# Altium schematic sheet 0241_GPU DECOUPLING_ V1.SchDoc
size 848 x 558 mm
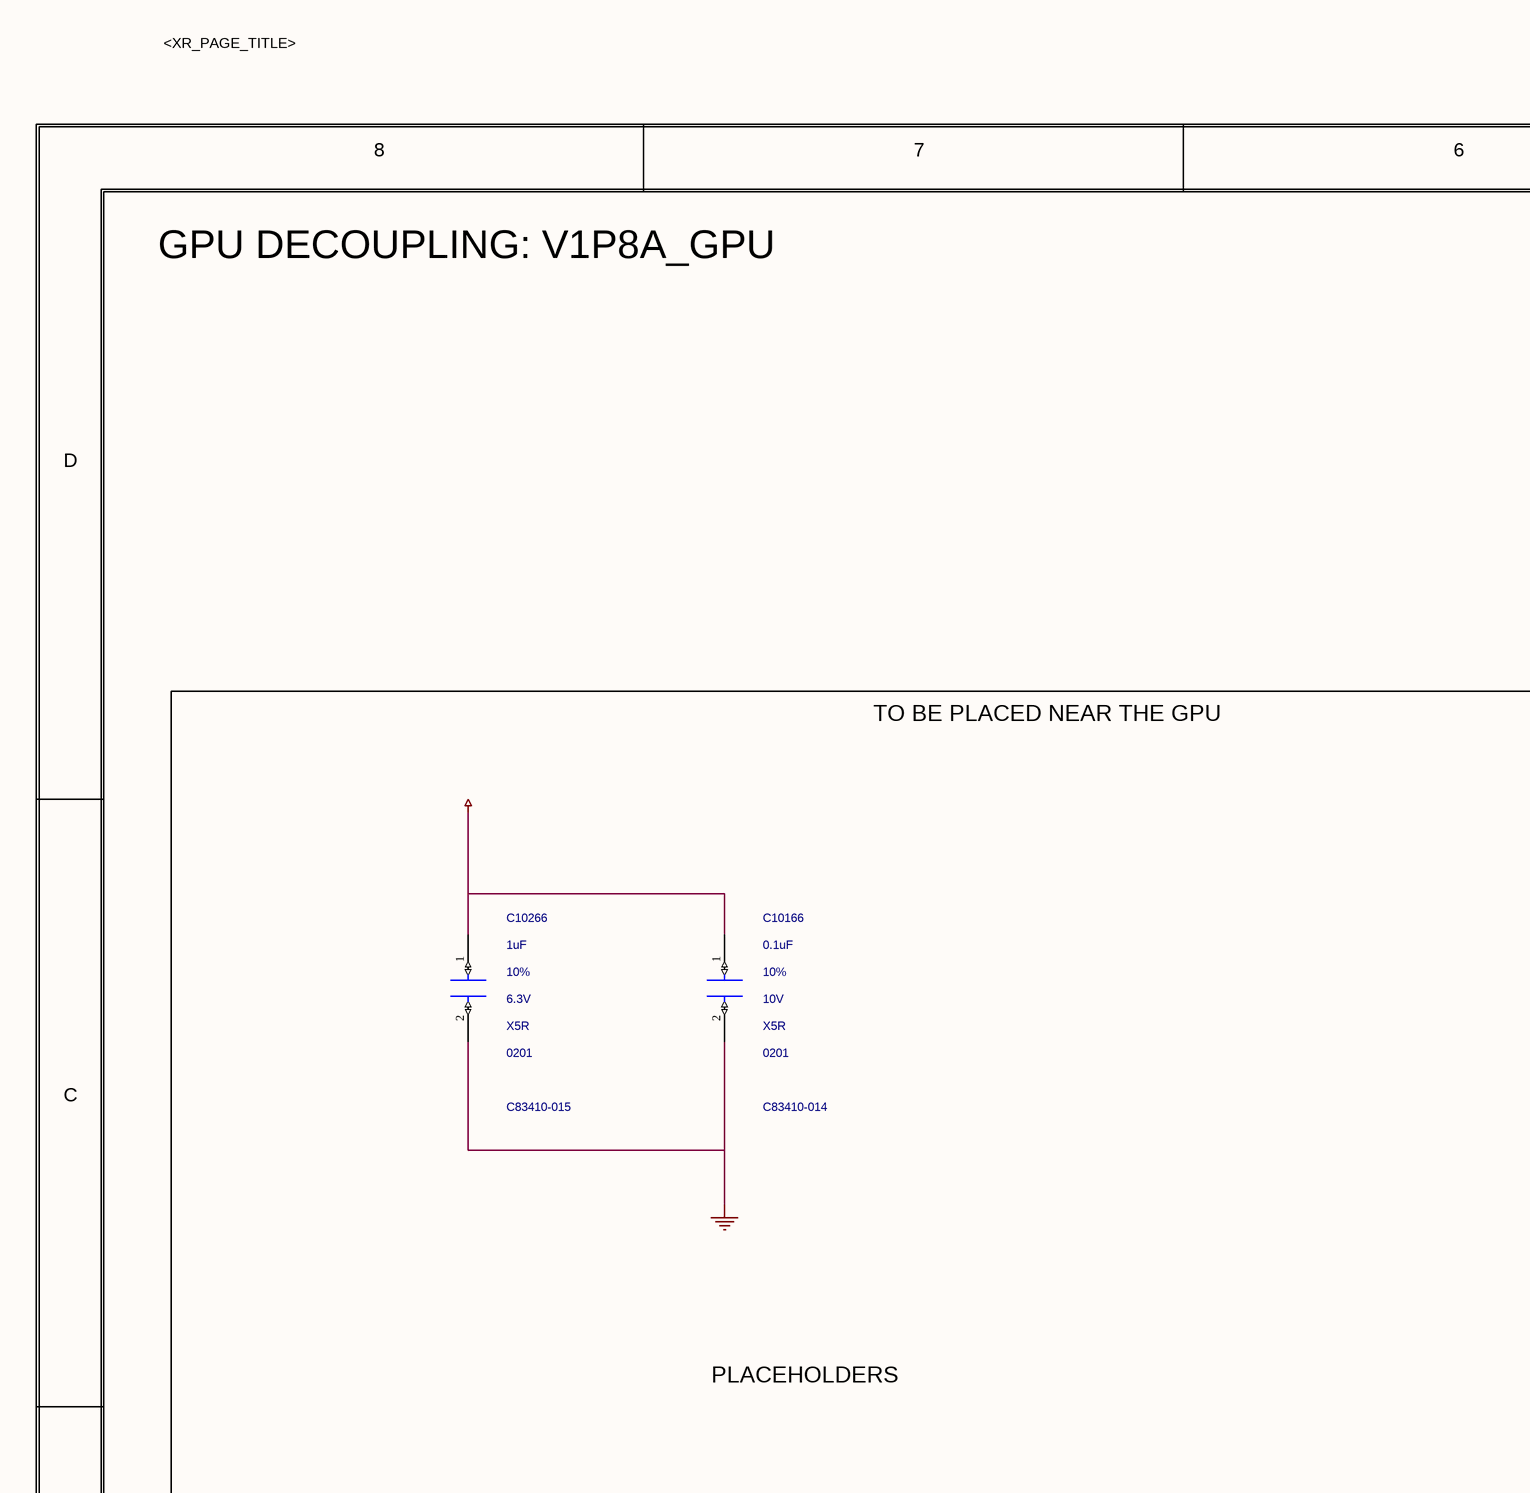
[diagram p0: 0241_GPU DECOUPLING_ V1.SchDoc, top left]
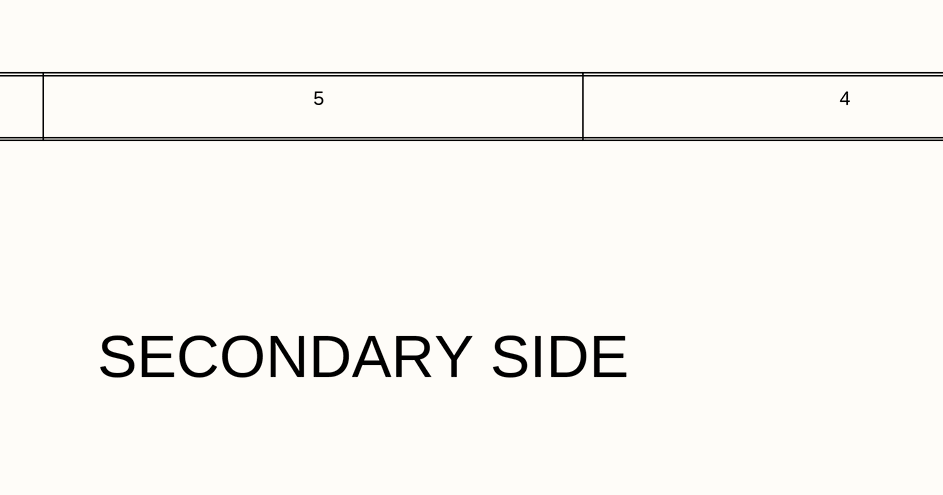
[diagram p1: 0241_GPU DECOUPLING_ V1.SchDoc, top middle]
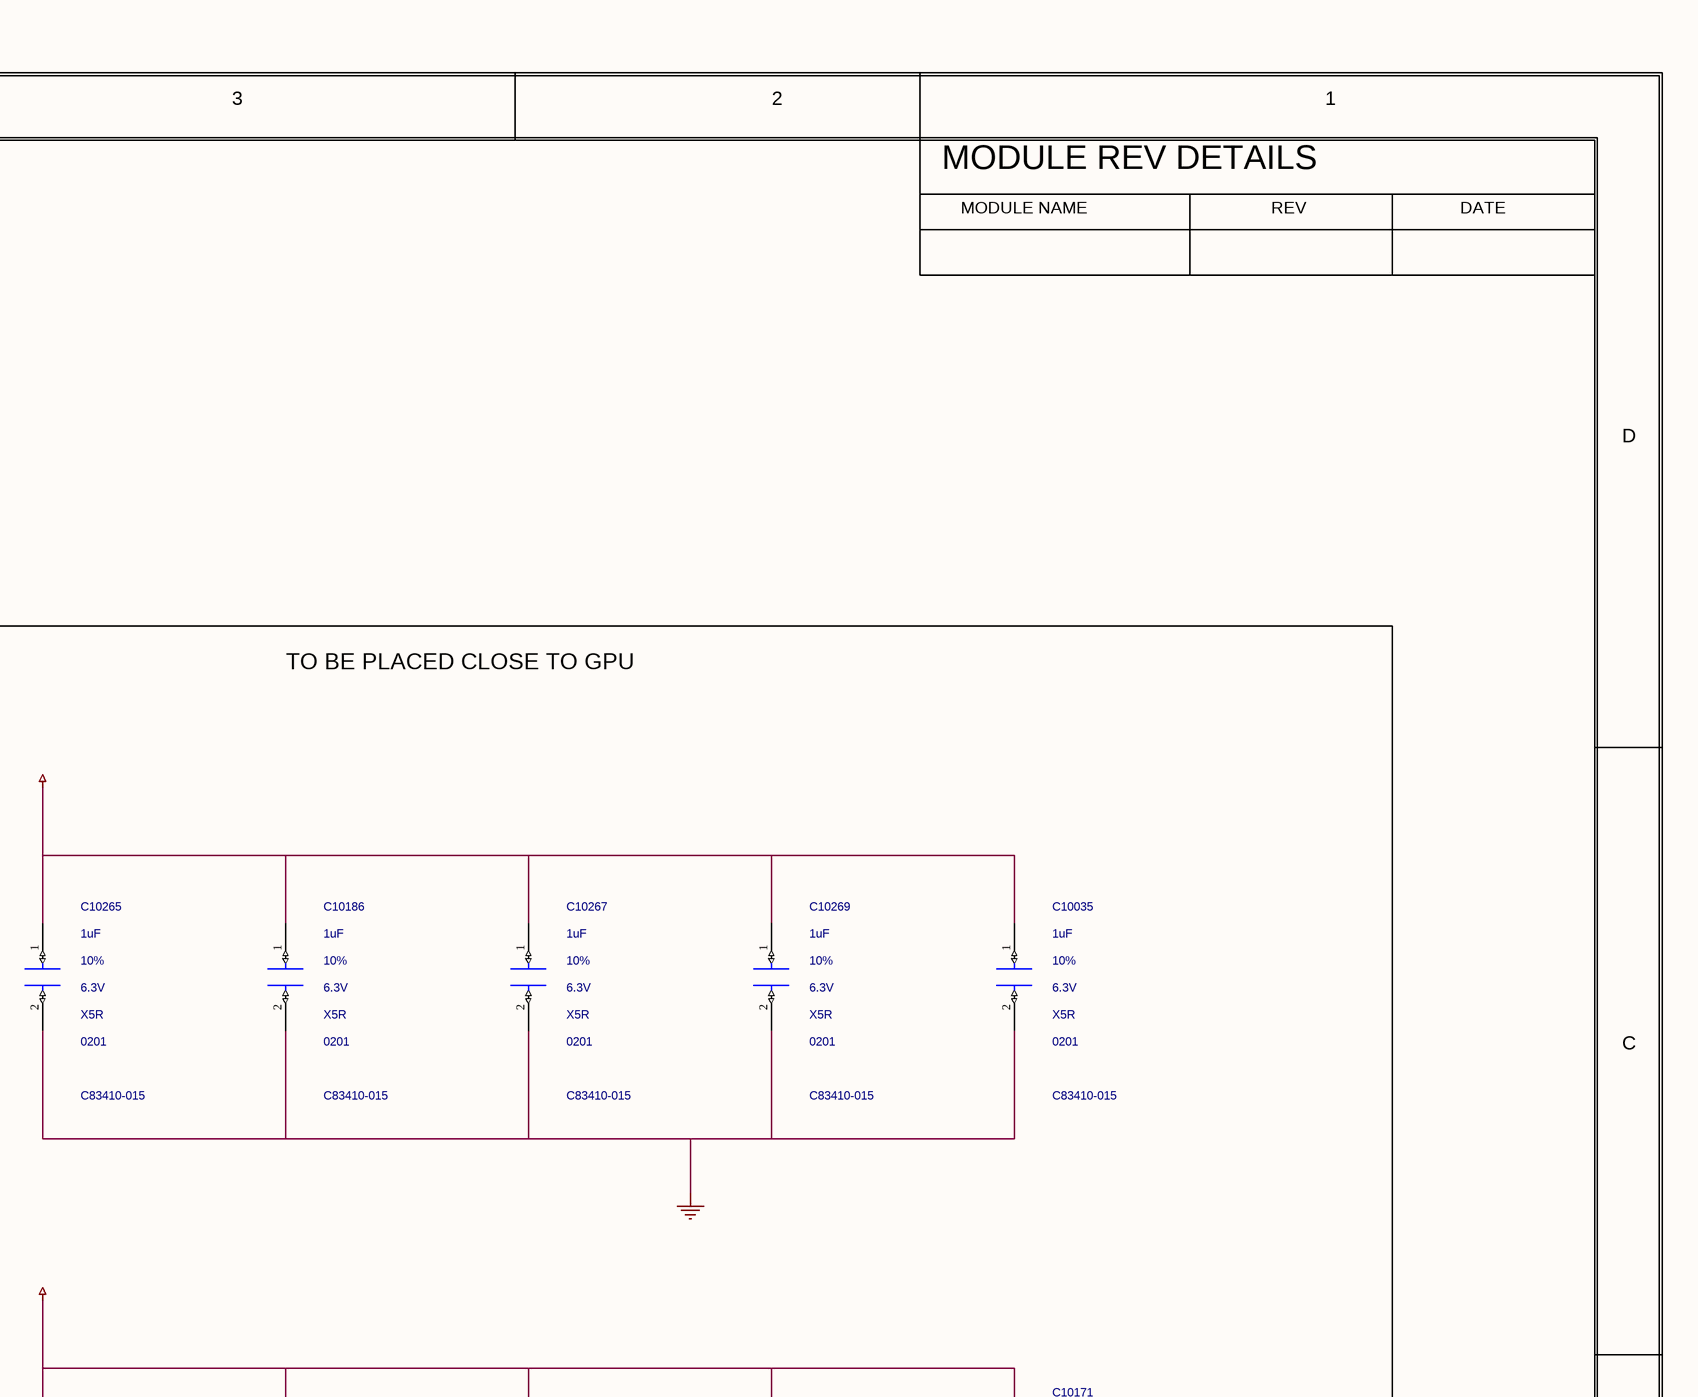
[diagram p2: 0241_GPU DECOUPLING_ V1.SchDoc, top right]
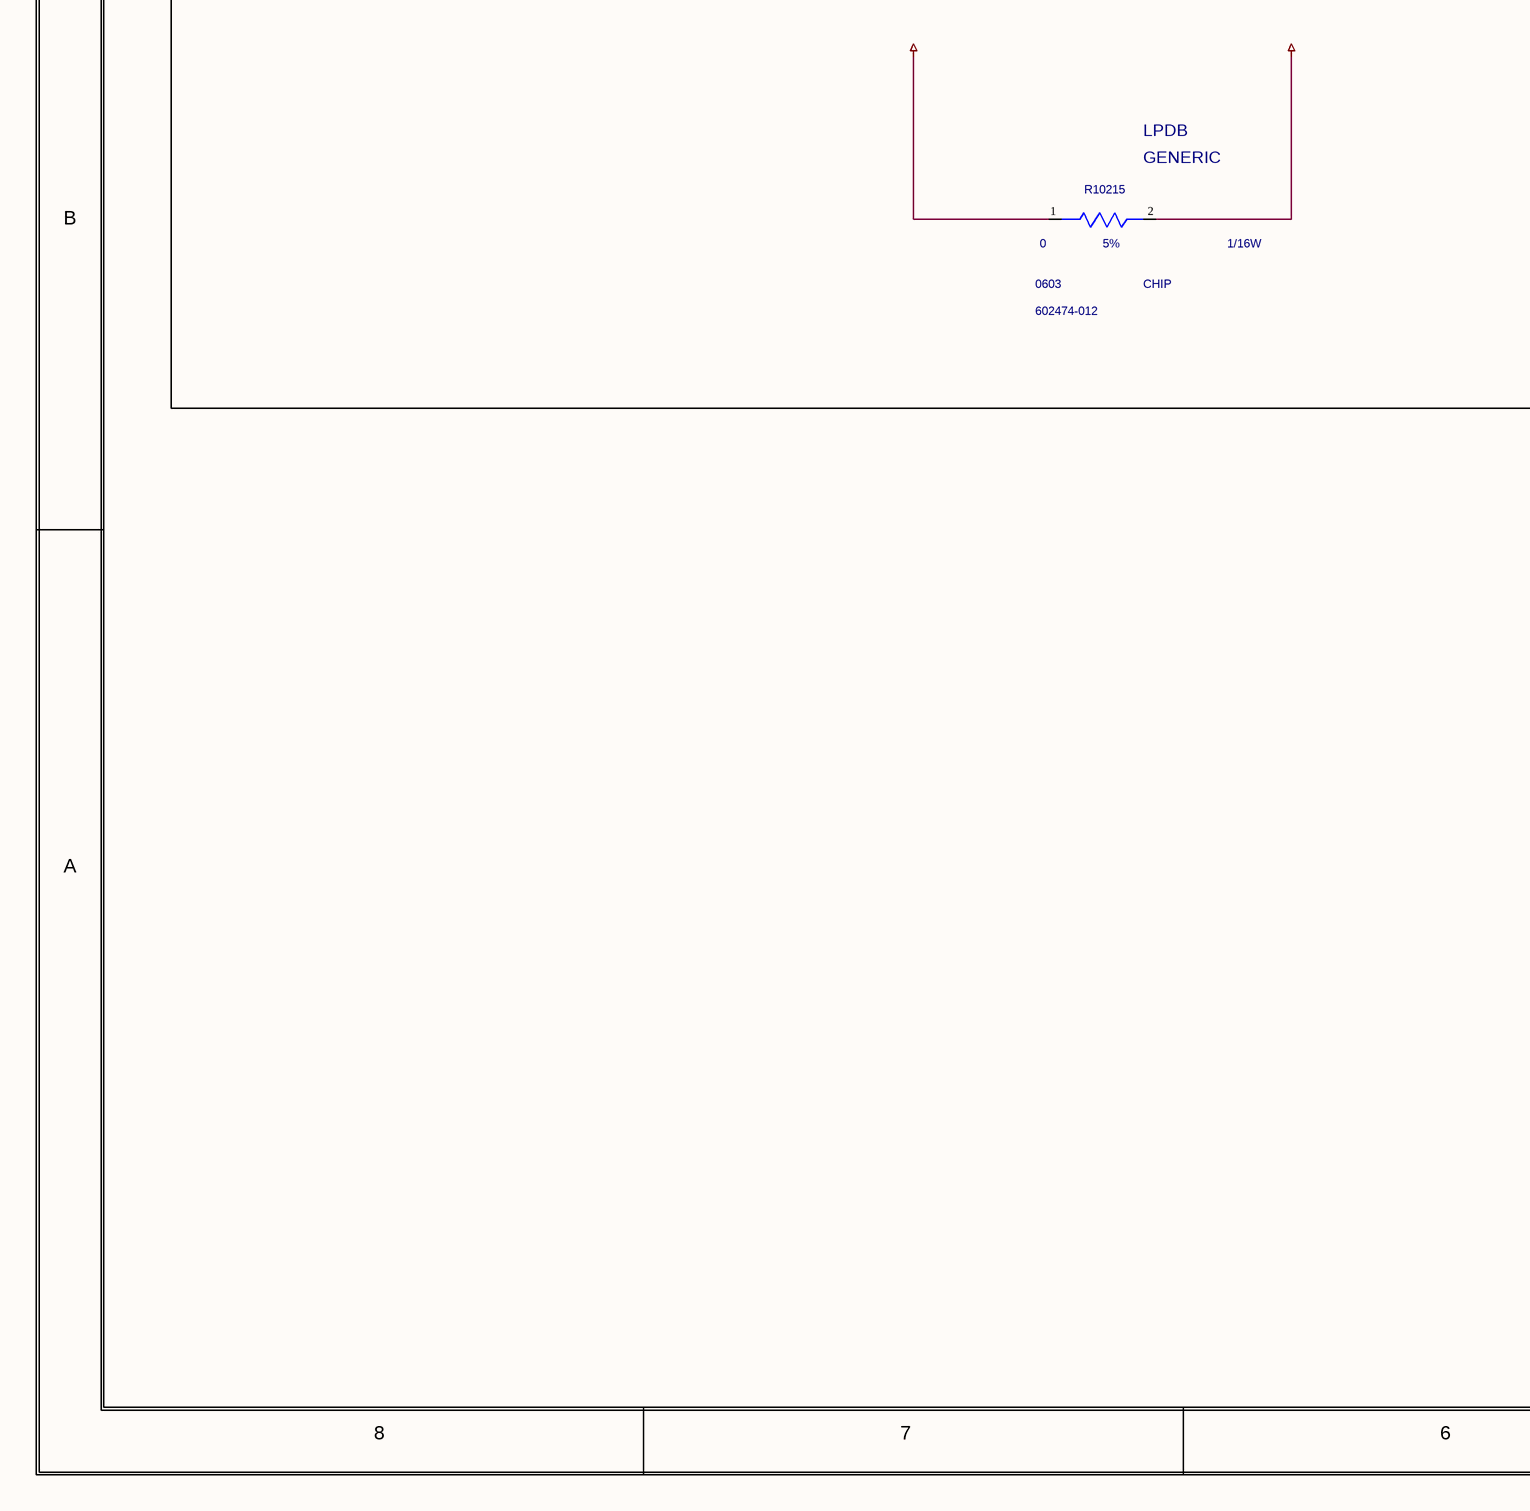
[diagram p3: 0241_GPU DECOUPLING_ V1.SchDoc, bottom left]
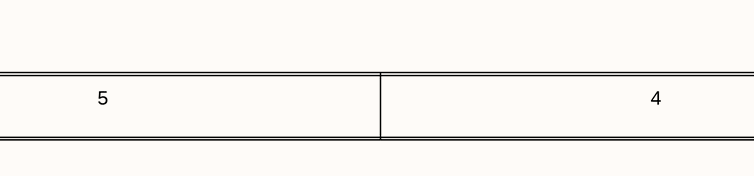
[diagram p4: 0241_GPU DECOUPLING_ V1.SchDoc, bottom middle]
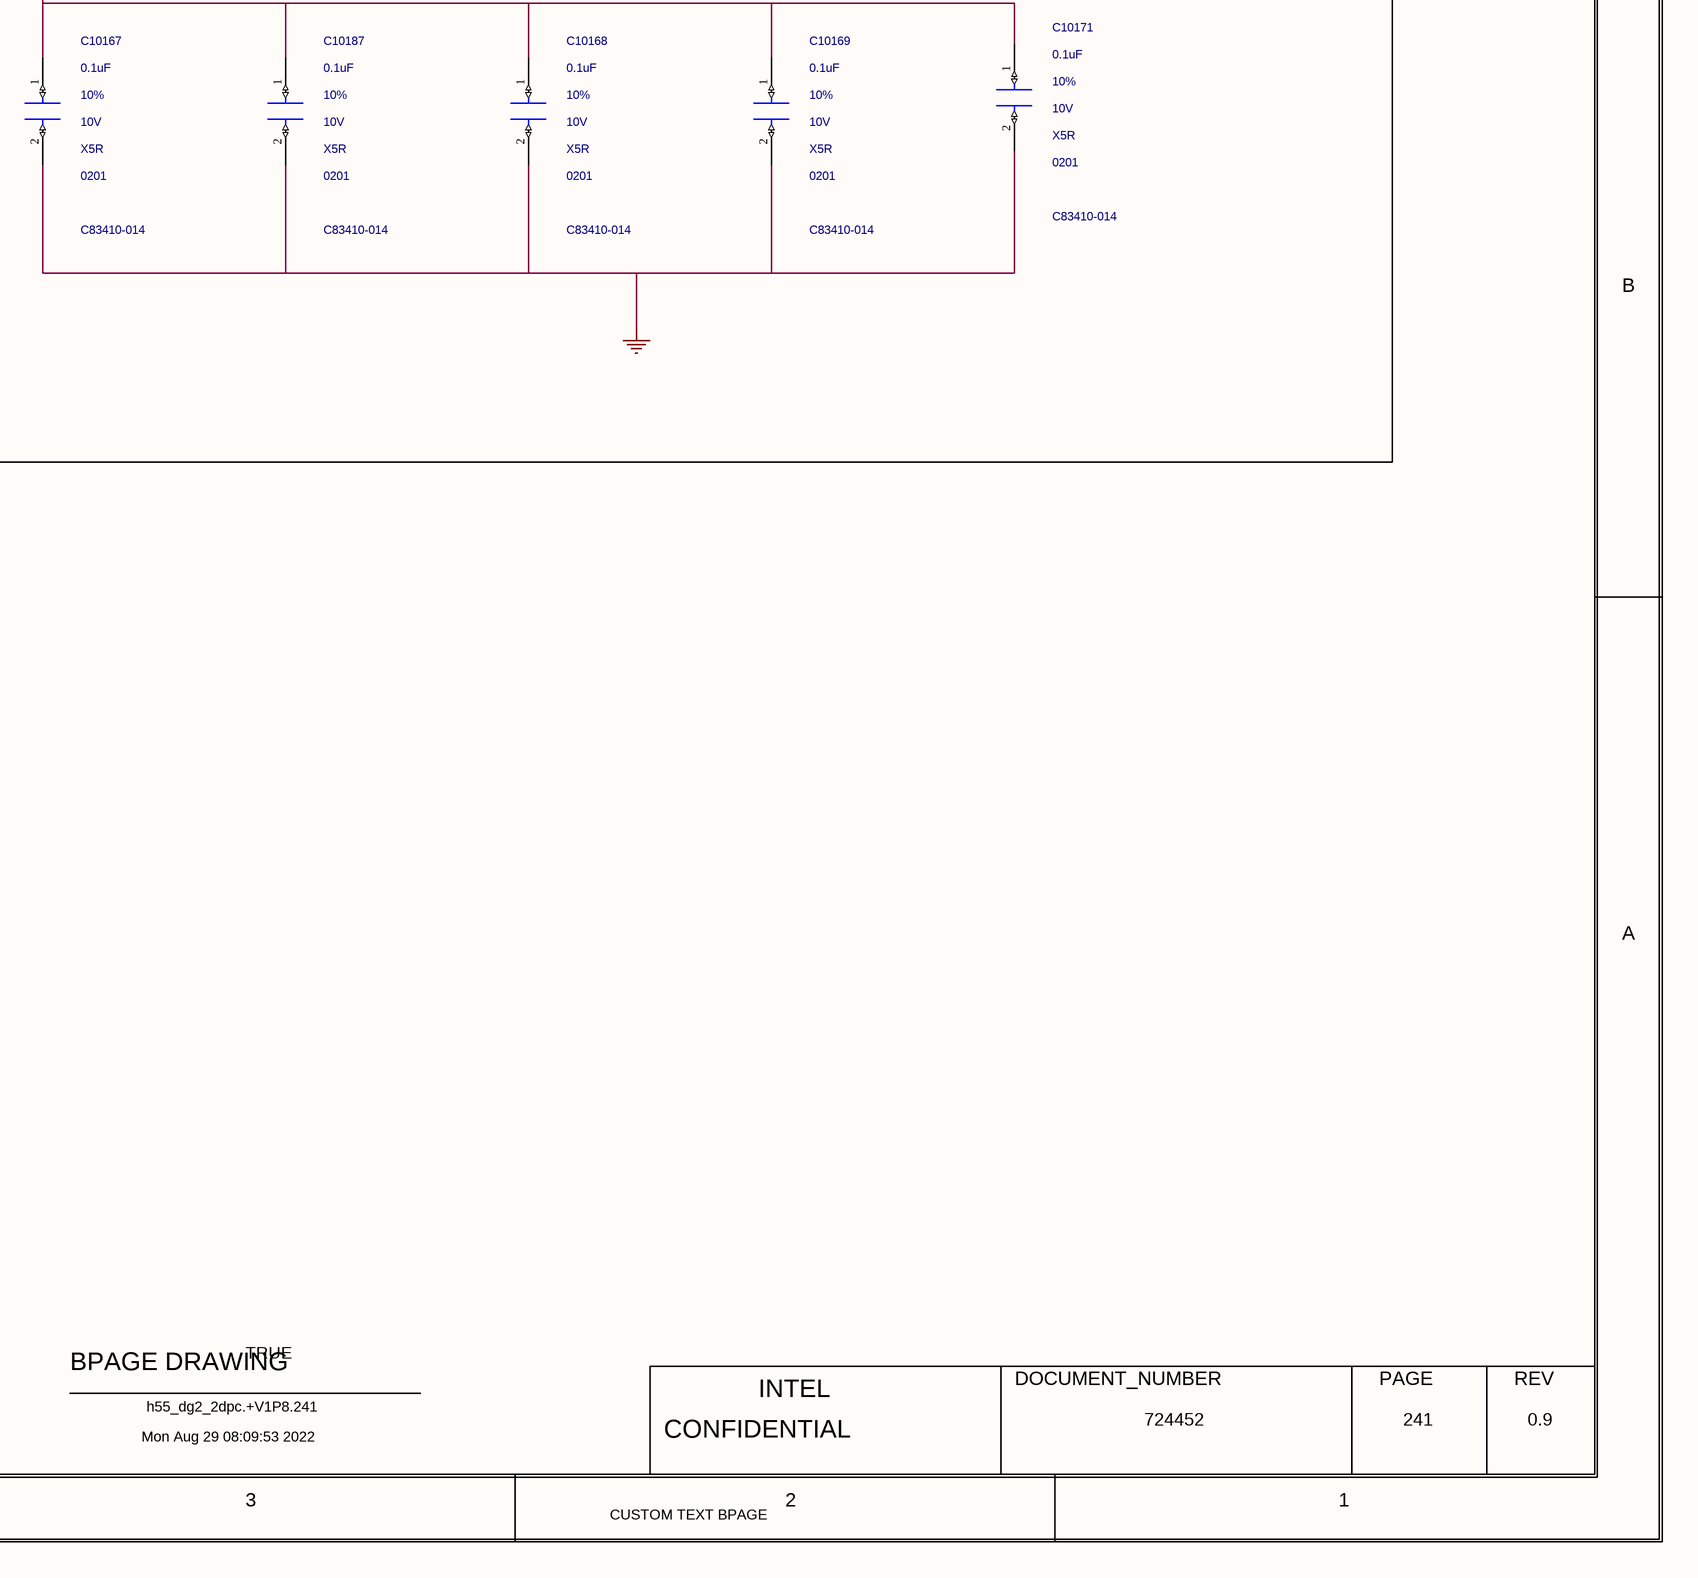
[diagram p5: 0241_GPU DECOUPLING_ V1.SchDoc, bottom right]

## Parts
C10035  1uF  MATERIAL: X5R  PACK_TYPE: 0201  PART_NUMBER: C83410-015  TOLERANCE: 10%  VOLTAGE: 6.3V  [SMC0201IA]
C10166  0.1uF  MATERIAL: X5R  PACK_TYPE: 0201  PART_NUMBER: C83410-014  TOLERANCE: 10%  VOLTAGE: 10V  [SMC0201IA]
C10167  0.1uF  MATERIAL: X5R  PACK_TYPE: 0201  PART_NUMBER: C83410-014  TOLERANCE: 10%  VOLTAGE: 10V  [SMC0201IA]
C10168  0.1uF  MATERIAL: X5R  PACK_TYPE: 0201  PART_NUMBER: C83410-014  TOLERANCE: 10%  VOLTAGE: 10V  [SMC0201IA]
C10169  0.1uF  MATERIAL: X5R  PACK_TYPE: 0201  PART_NUMBER: C83410-014  TOLERANCE: 10%  VOLTAGE: 10V  [SMC0201IA]
C10171  0.1uF  MATERIAL: X5R  PACK_TYPE: 0201  PART_NUMBER: C83410-014  TOLERANCE: 10%  VOLTAGE: 10V  [SMC0201IA]
C10186  1uF  MATERIAL: X5R  PACK_TYPE: 0201  PART_NUMBER: C83410-015  TOLERANCE: 10%  VOLTAGE: 6.3V  [SMC0201IA]
C10187  0.1uF  MATERIAL: X5R  PACK_TYPE: 0201  PART_NUMBER: C83410-014  TOLERANCE: 10%  VOLTAGE: 10V  [SMC0201IA]
C10265  1uF  MATERIAL: X5R  PACK_TYPE: 0201  PART_NUMBER: C83410-015  TOLERANCE: 10%  VOLTAGE: 6.3V  [SMC0201IA]
C10266  1uF  MATERIAL: X5R  PACK_TYPE: 0201  PART_NUMBER: C83410-015  TOLERANCE: 10%  VOLTAGE: 6.3V  [SMC0201IA]
C10267  1uF  MATERIAL: X5R  PACK_TYPE: 0201  PART_NUMBER: C83410-015  TOLERANCE: 10%  VOLTAGE: 6.3V  [SMC0201IA]
C10269  1uF  MATERIAL: X5R  PACK_TYPE: 0201  PART_NUMBER: C83410-015  TOLERANCE: 10%  VOLTAGE: 6.3V  [SMC0201IA]
R10215  0  MATERIAL: CHIP  PACK_TYPE: 0603  PART_NUMBER: 602474-012  TOLERANCE: 5%  WATTAGE: 1/16W  IP: GENERIC  FP_TECH: LPDB  [SMR0603IA]

## Blocks framed on the sheet
TO BE PLACED CLOSE TO GPU: C10035 C10167-C10169 C10171 C10186 C10187 C10265 C10267 C10269

## Nets
+V1P8_PLLVPH: C10166.1(A) C10266.1(A) R10215.1(A)
+V1P8S_GPU: C10035.1(A) C10167.1(A) C10168.1(A) C10169.1(A) C10171.1(A) C10186.1(A) C10187.1(A) C10265.1(A) C10267.1(A) C10269.1(A) R10215.2(B)
GND: C10035.2(B) C10166.2(B) C10167.2(B) C10168.2(B) C10169.2(B) C10171.2(B) C10186.2(B) C10187.2(B) C10265.2(B) C10266.2(B) C10267.2(B) C10269.2(B)

## Notes on the sheet
- <XR_PAGE_TITLE>
- 8
- 7
- 6
- 5
- 4
- 3
- 2
- 1
- MODULE REV DETAILS
- GPU DECOUPLING: V1P8A_GPU
- MODULE NAME
- REV
- DATE
- SECONDARY SIDE
- D
- TO BE PLACED NEAR THE GPU
- C
- PLACEHOLDERS
- B
- A
- BPAGE DRAWING
- TRUE
- INTEL
- DOCUMENT_NUMBER
- PAGE
- Mon Aug 29 08:09:53 2022
- h55_dg2_2dpc.+V1P8.241
- CONFIDENTIAL
- 724452
- 241
- 0.9
- CUSTOM TEXT BPAGE

## Library data of the parts
C10035 = CAP: CDS_PHYS_PART_NAME: CAP_0201-C83410-015,X5R,1UF,6.3V,10%,LPDB,GENERIC; OriginalSymbolOrigin: (-50,25); XY: (-1075,3450); VER: 1; ROT: 0; PHYS_PAGE: 241; LOCATION: C10035; DRAWING: @RVP1_ADL_SB_ADP_S_DDR5_SODIMM_2DPC_LIB.H55_DG2_2DPC(SCH_1):PAGE412; CDS_LIB: discrete; PCB Footprint: SMC0201IA; CHIPS_PART_NAME: CAP; CDS_PART_NAME: CAP_0201-C83410-015,X5R,1UF,6.3V,10%,LPDB,GENERIC; CDS_LOCATION: C10035
C10166 = CAP: CDS_PHYS_PART_NAME: CAP_0201-C83410-014,X5R,0.1UF,10V,10%,LPDB,GENERIC; OriginalSymbolOrigin: (-50,25); XY: (-6850,3525); VER: 1; ROT: 0; PHYS_PAGE: 241; LOCATION: C10166; DRAWING: @RVP1_ADL_SB_ADP_S_DDR5_SODIMM_2DPC_LIB.H55_DG2_2DPC(SCH_1):PAGE412; CDS_LIB: discrete; PCB Footprint: SMC0201IA; CHIPS_PART_NAME: CAP; CDS_PART_NAME: CAP_0201-C83410-014,X5R,0.1UF,10V,10%,LPDB,GENERIC; CDS_LOCATION: C10166
C10167 = CAP: CDS_PHYS_PART_NAME: CAP_0201-C83410-014,X5R,0.1UF,10V,10%,LPDB,GENERIC; OriginalSymbolOrigin: (-50,25); XY: (-2875,2525); VER: 1; ROT: 0; PHYS_PAGE: 241; LOCATION: C10167; DRAWING: @RVP1_ADL_SB_ADP_S_DDR5_SODIMM_2DPC_LIB.H55_DG2_2DPC(SCH_1):PAGE412; CDS_LIB: discrete; PCB Footprint: SMC0201IA; CHIPS_PART_NAME: CAP; CDS_PART_NAME: CAP_0201-C83410-014,X5R,0.1UF,10V,10%,LPDB,GENERIC; CDS_LOCATION: C10167
C10168 = CAP: CDS_PHYS_PART_NAME: CAP_0201-C83410-014,X5R,0.1UF,10V,10%,LPDB,GENERIC; OriginalSymbolOrigin: (-50,25); XY: (-1975,2525); VER: 1; ROT: 0; PHYS_PAGE: 241; LOCATION: C10168; DRAWING: @RVP1_ADL_SB_ADP_S_DDR5_SODIMM_2DPC_LIB.H55_DG2_2DPC(SCH_1):PAGE412; CDS_LIB: discrete; PCB Footprint: SMC0201IA; CHIPS_PART_NAME: CAP; CDS_PART_NAME: CAP_0201-C83410-014,X5R,0.1UF,10V,10%,LPDB,GENERIC; CDS_LOCATION: C10168
C10169 = CAP: CDS_PHYS_PART_NAME: CAP_0201-C83410-014,X5R,0.1UF,10V,10%,LPDB,GENERIC; OriginalSymbolOrigin: (-50,25); XY: (-1525,2525); VER: 1; ROT: 0; PHYS_PAGE: 241; LOCATION: C10169; DRAWING: @RVP1_ADL_SB_ADP_S_DDR5_SODIMM_2DPC_LIB.H55_DG2_2DPC(SCH_1):PAGE412; CDS_LIB: discrete; PCB Footprint: SMC0201IA; CHIPS_PART_NAME: CAP; CDS_PART_NAME: CAP_0201-C83410-014,X5R,0.1UF,10V,10%,LPDB,GENERIC; CDS_LOCATION: C10169
C10171 = CAP: CDS_PHYS_PART_NAME: CAP_0201-C83410-014,X5R,0.1UF,10V,10%,LPDB,GENERIC; OriginalSymbolOrigin: (-50,25); XY: (-1075,2550); VER: 1; ROT: 0; PHYS_PAGE: 241; LOCATION: C10171; DRAWING: @RVP1_ADL_SB_ADP_S_DDR5_SODIMM_2DPC_LIB.H55_DG2_2DPC(SCH_1):PAGE412; CDS_LIB: discrete; PCB Footprint: SMC0201IA; CHIPS_PART_NAME: CAP; CDS_PART_NAME: CAP_0201-C83410-014,X5R,0.1UF,10V,10%,LPDB,GENERIC; CDS_LOCATION: C10171
C10186 = CAP: CDS_PHYS_PART_NAME: CAP_0201-C83410-015,X5R,1UF,6.3V,10%,LPDB,GENERIC; OriginalSymbolOrigin: (-50,25); XY: (-2425,3450); VER: 1; ROT: 0; PHYS_PAGE: 241; LOCATION: C10186; DRAWING: @RVP1_ADL_SB_ADP_S_DDR5_SODIMM_2DPC_LIB.H55_DG2_2DPC(SCH_1):PAGE412; CDS_LIB: discrete; PCB Footprint: SMC0201IA; CHIPS_PART_NAME: CAP; CDS_PART_NAME: CAP_0201-C83410-015,X5R,1UF,6.3V,10%,LPDB,GENERIC; CDS_LOCATION: C10186
C10187 = CAP: CDS_PHYS_PART_NAME: CAP_0201-C83410-014,X5R,0.1UF,10V,10%,LPDB,GENERIC; OriginalSymbolOrigin: (-50,25); XY: (-2425,2525); VER: 1; ROT: 0; PHYS_PAGE: 241; LOCATION: C10187; DRAWING: @RVP1_ADL_SB_ADP_S_DDR5_SODIMM_2DPC_LIB.H55_DG2_2DPC(SCH_1):PAGE412; CDS_LIB: discrete; PCB Footprint: SMC0201IA; CHIPS_PART_NAME: CAP; CDS_PART_NAME: CAP_0201-C83410-014,X5R,0.1UF,10V,10%,LPDB,GENERIC; CDS_LOCATION: C10187
C10265 = CAP: CDS_PHYS_PART_NAME: CAP_0201-C83410-015,X5R,1UF,6.3V,10%,LPDB,GENERIC; OriginalSymbolOrigin: (-50,25); XY: (-2875,3450); VER: 1; ROT: 0; PHYS_PAGE: 241; LOCATION: C10265; DRAWING: @RVP1_ADL_SB_ADP_S_DDR5_SODIMM_2DPC_LIB.H55_DG2_2DPC(SCH_1):PAGE412; CDS_LIB: discrete; PCB Footprint: SMC0201IA; CHIPS_PART_NAME: CAP; CDS_PART_NAME: CAP_0201-C83410-015,X5R,1UF,6.3V,10%,LPDB,GENERIC; CDS_LOCATION: C10265
C10266 = CAP: CDS_PHYS_PART_NAME: CAP_0201-C83410-015,X5R,1UF,6.3V,10%,LPDB,GENERIC; OriginalSymbolOrigin: (-50,25); XY: (-7325,3525); VER: 1; ROT: 0; PHYS_PAGE: 241; LOCATION: C10266; DRAWING: @RVP1_ADL_SB_ADP_S_DDR5_SODIMM_2DPC_LIB.H55_DG2_2DPC(SCH_1):PAGE412; CDS_LIB: discrete; PCB Footprint: SMC0201IA; CHIPS_PART_NAME: CAP; CDS_PART_NAME: CAP_0201-C83410-015,X5R,1UF,6.3V,10%,LPDB,GENERIC; CDS_LOCATION: C10266
C10267 = CAP: CDS_PHYS_PART_NAME: CAP_0201-C83410-015,X5R,1UF,6.3V,10%,LPDB,GENERIC; OriginalSymbolOrigin: (-50,25); XY: (-1975,3450); VER: 1; ROT: 0; PHYS_PAGE: 241; LOCATION: C10267; DRAWING: @RVP1_ADL_SB_ADP_S_DDR5_SODIMM_2DPC_LIB.H55_DG2_2DPC(SCH_1):PAGE412; CDS_LIB: discrete; PCB Footprint: SMC0201IA; CHIPS_PART_NAME: CAP; CDS_PART_NAME: CAP_0201-C83410-015,X5R,1UF,6.3V,10%,LPDB,GENERIC; CDS_LOCATION: C10267
C10269 = CAP: CDS_PHYS_PART_NAME: CAP_0201-C83410-015,X5R,1UF,6.3V,10%,LPDB,GENERIC; OriginalSymbolOrigin: (-50,25); XY: (-1525,3450); VER: 1; ROT: 0; PHYS_PAGE: 241; LOCATION: C10269; DRAWING: @RVP1_ADL_SB_ADP_S_DDR5_SODIMM_2DPC_LIB.H55_DG2_2DPC(SCH_1):PAGE412; CDS_LIB: discrete; PCB Footprint: SMC0201IA; CHIPS_PART_NAME: CAP; CDS_PART_NAME: CAP_0201-C83410-015,X5R,1UF,6.3V,10%,LPDB,GENERIC; CDS_LOCATION: C10269
R10215 = RES#1: CHIPS_PART_NAME: RES; CDS_PHYS_PART_NAME: RES_0603-602474-012,CHIP,0,5%,1/16W,LPDB,GENERIC; OriginalSymbolOrigin: (-75,25); XY: (-6150,2200); VER: 1; PHYS_PAGE: 241; LOCATION: R10215; DRAWING: @RVP1_ADL_SB_ADP_S_DDR5_SODIMM_2DPC_LIB.H55_DG2_2DPC(SCH_1):PAGE412; CDS_LIB: discrete; PCB Footprint: SMR0603IA; ROT: 0; CDS_PART_NAME: RES_0603-602474-012,CHIP,0,5%,1/16W,LPDB,GENERIC; CDS_LOCATION: R10215